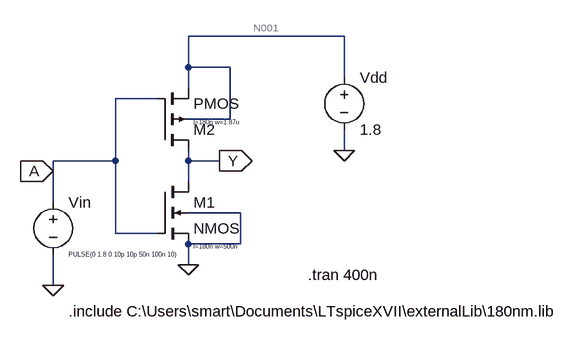
[diagram p0: schematic CMOSInverter1.asc]
CMOSInverter1.asc, the LTspice schematic file:
Version 4
SHEET 1 880 680
WIRE 352 -32 112 -32
WIRE 112 16 112 -32
WIRE 176 16 112 16
WIRE 352 32 352 -32
WIRE 112 48 112 16
WIRE 64 64 0 64
WIRE 176 96 176 16
WIRE 176 96 112 96
WIRE 352 144 352 112
WIRE 0 160 0 64
WIRE 0 160 -96 160
WIRE 112 160 112 144
WIRE 160 160 112 160
WIRE -96 176 -96 160
WIRE 112 192 112 160
WIRE -96 224 -96 176
WIRE 192 240 112 240
WIRE 0 272 0 160
WIRE 64 272 0 272
WIRE 192 288 192 240
WIRE 192 288 112 288
WIRE 112 320 112 288
WIRE -96 352 -96 304
FLAG 352 144 0
FLAG 112 320 0
FLAG -96 352 0
FLAG -96 176 A
IOPIN -96 176 In
FLAG 160 160 Y
IOPIN 160 160 Out
SYMBOL nmos4 64 192 R0
WINDOW 123 56 100 Left 0
SYMATTR Value2 l=180n w=500n
SYMATTR InstName M1
SYMBOL pmos4 64 144 M180
WINDOW 123 56 44 Left 0
SYMATTR Value2 l=180n w=1.87u
SYMATTR InstName M2
SYMBOL voltage 352 16 R0
WINDOW 123 0 0 Left 0
WINDOW 39 0 0 Left 0
SYMATTR InstName Vdd
SYMATTR Value 1.8
SYMBOL voltage -96 208 R0
WINDOW 3 24 96 Left 0
WINDOW 123 0 0 Left 0
WINDOW 39 0 0 Left 0
SYMATTR Value PULSE(0 1.8 0 10p 10p 50n 100n 10)
SYMATTR InstName Vin
TEXT -72 392 Left 2 !.include C:\\Users\\smart\\Documents\\LTspiceXVII\\externalLib\\180nm.lib
TEXT 296 336 Left 2 !.tran 400n

The netlist it stands for:
* CMOSInverter1.asc
M1 Y A 0 0 NMOS l=180n w=500n
M2 Y A N001 N001 PMOS l=180n w=1.87u
Vdd N001 0 1.8
Vin A 0 PULSE(0 1.8 0 10p 10p 50n 100n 10)
.model NMOS NMOS
.model PMOS PMOS
.lib standard.mos
.include C:\Users\smart\Documents\LTspiceXVII\externalLib\180nm.lib
.tran 400n
.backanno
.end

* Results of the author's LTspice run, read from the files saved beside the schematic
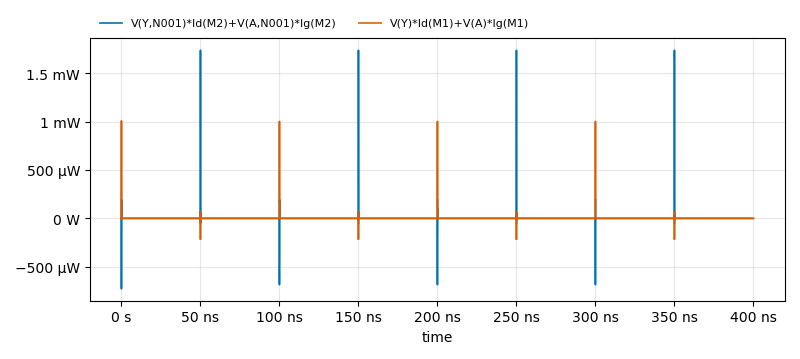
[diagram p1: Transient Analysis of CMOSInverter1.asc, plotted from the saved traces]
* Transient Analysis, 1 run:
*   V(Y,N001)*Id(M2)+V(A,N001)*Ig(M2): min -727.5 µW, max 1.735 mW, average 99.92 nW, rms 12.3 µW, last 0 W
*   V(Y)*Id(M1)+V(A)*Ig(M1): min -216.8 µW, max 1.007 mW, average 90.78 nW, rms 7.67 µW, last 0 W